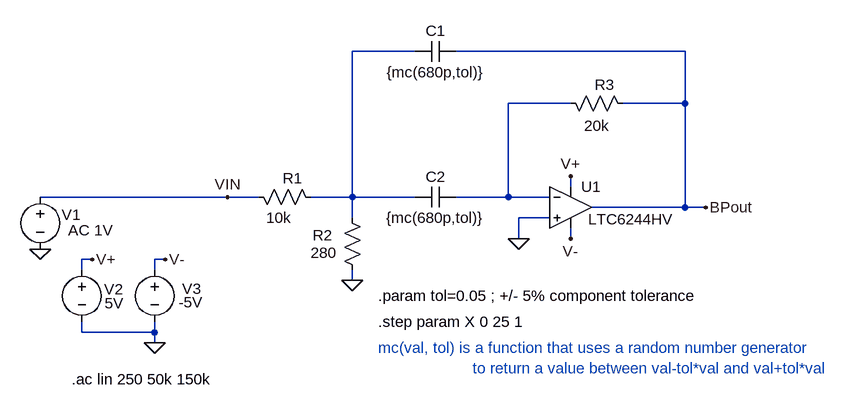
[diagram p0: schematic BPF 100kHz  Cap Variation.asc]
BPF 100kHz  Cap Variation.asc, the LTspice schematic file:
Version 4
SHEET 1 2508 1688
WIRE 704 288 608 288
WIRE 1120 288 768 288
WIRE 944 368 848 368
WIRE 1120 368 1120 288
WIRE 1120 368 1024 368
WIRE 944 496 944 480
WIRE 416 512 128 512
WIRE 464 512 416 512
WIRE 608 512 608 288
WIRE 608 512 544 512
WIRE 704 512 608 512
WIRE 848 512 848 368
WIRE 848 512 768 512
WIRE 912 512 848 512
WIRE 1120 528 1120 368
WIRE 1120 528 976 528
WIRE 1152 528 1120 528
WIRE 608 544 608 512
WIRE 912 544 864 544
WIRE 864 576 864 544
WIRE 944 576 944 560
WIRE 208 608 192 608
WIRE 320 608 304 608
WIRE 192 624 192 608
WIRE 304 624 304 608
WIRE 608 640 608 624
WIRE 192 720 192 704
WIRE 304 720 304 704
WIRE 304 720 192 720
WIRE 304 736 304 720
FLAG 128 592 0
FLAG 416 512 VIN
FLAG 608 640 0
FLAG 1152 528 BPout
FLAG 864 576 0
FLAG 208 608 V+
FLAG 320 608 V-
FLAG 304 736 0
FLAG 944 576 V-
FLAG 944 480 V+
SYMBOL VOLTAGE 128 496 R0
WINDOW 39 0 0 Left 2
WINDOW 123 43 67 Left 2
WINDOW 0 33 43 Left 2
WINDOW 3 12 96 Invisible 2
SYMATTR Value2 AC 1V
SYMATTR InstName V1
SYMATTR Value ""
SYMBOL res 592 528 R0
WINDOW 0 -45 43 Left 2
WINDOW 3 -48 70 Left 2
SYMATTR InstName R2
SYMATTR Value 280
SYMBOL cap 768 528 M270
WINDOW 0 32 32 VTop 2
WINDOW 3 0 32 VBottom 2
SYMATTR InstName C2
SYMATTR Value {mc(680p,tol)}
SYMBOL cap 768 304 M270
WINDOW 0 32 32 VTop 2
WINDOW 3 0 31 VBottom 2
SYMATTR InstName C1
SYMATTR Value {mc(680p,tol)}
SYMBOL RES 928 352 M90
WINDOW 0 3 68 VBottom 2
WINDOW 3 35 56 VTop 2
SYMATTR InstName R3
SYMATTR Value 20k
SYMBOL RES 448 496 M90
WINDOW 0 3 68 VBottom 2
WINDOW 3 32 47 VTop 2
SYMATTR InstName R1
SYMATTR Value 10k
SYMBOL voltage 192 608 R0
WINDOW 0 34 46 Left 2
WINDOW 3 35 67 Left 2
WINDOW 123 0 0 Left 2
WINDOW 39 0 0 Left 2
SYMATTR InstName V2
SYMATTR Value 5V
SYMBOL voltage 304 608 R0
WINDOW 0 42 45 Left 2
WINDOW 3 37 66 Left 2
SYMATTR InstName V3
SYMATTR Value -5V
SYMBOL Opamps\\LTC6244HV 944 528 R0
WINDOW 3 27 18 Left 2
SYMATTR InstName U1
TEXT 176 792 Left 2 !.ac lin 250 50k 150k
TEXT 648 704 Left 2 !.step param X 0 25 1
TEXT 648 664 Left 2 !.param tol=0.05 ; +/- 5% component tolerance
TEXT 648 744 Left 2 ;mc(val, tol) is a function that uses a random number generator \n                     to return a value between val-tol*val and val+tol*val

The netlist it stands for:
* BPF 100kHz  Cap Variation.asc
V1 VIN 0 AC 1V
R2 N001 0 280
C2 N002 N001 {mc(680p,tol)}
C1 BPout N001 {mc(680p,tol)}
R3 N002 BPout 20k
R1 VIN N001 10k
V2 V+ 0 5V
V3 V- 0 -5V
XU1 0 N002 V+ V- BPout LTC6244HV  ; pins In+ In- V+ V- OUT
.ac lin 250 50k 150k
.step param X 0 25 1
.param tol=0.05 ; +/- 5% component tolerance
* mc(val, tol) is a function that uses a random number generator
*                      to return a value between val-tol*val and val+tol*val
.lib LTC5.lib
.backanno
.end